# Altium schematic sheet 热敏开关-modifi.SchDoc
size A4
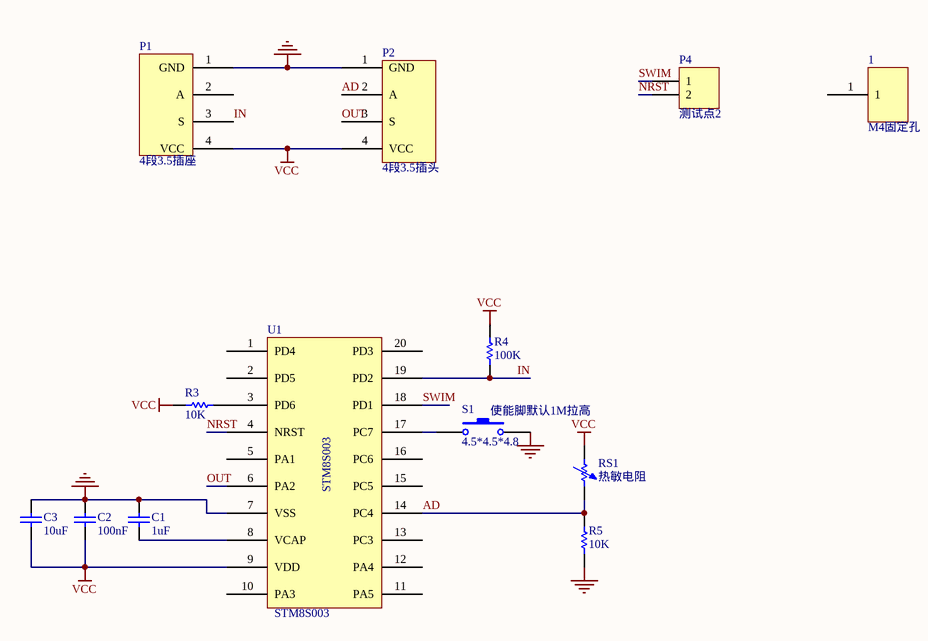
[diagram p0: 热敏开关-modifi.SchDoc]

## Parts
1  M4固定孔  [M4固定孔]
C1  1uF  [0603C]
C2  100nF  [0603C]
C3  10uF  [0603C]
P1  4段3.5插座  [4段3.5耳机贴片座]
P2  4段3.5插头  [4段3.5插头]
P4  测试点2  [2SMT-2.54]
R3  10K  [0603R]
R4  100K  [0603R]
R5  10K  [0603R]
RS1  热敏电阻  [PH2.0-2P]
S1  4.5*4.5*4.8  [按键4.5*4.5*4.8]
U1  STM8S003  [TSSOP20]

## Nets
GND: C1.2 C2.2 C3.2 P1.1(GND) P2.1(GND) R5.1 S1.2 U1.7(VSS)
VCC: C2.1 C3.1 P1.4(VCC) P2.4(VCC) R3.2 R4.1 RS1.1 U1.9(VDD)
AD: P2.2(A) R5.2 RS1.2 U1.14(PC4)
IN: P1.3(S) R4.2 U1.19(PD2)
NRST: P4.2 U1.4(NRST)
OUT: P2.3(S) U1.6(PA2)
SWIM: P4.1 U1.18(PD1)
NetC1_1: C1.1 U1.8(VCAP)
NetR3_1: R3.1 U1.3(PD6)
NetS1_1: S1.1 U1.17(PC7)

Not connected (* = marked no-connect by the designer): 1 1; P1 2(A); U1 1(PD4) 2(PD5) 5(PA1) 10(PA3) 11(PA5) 12(PA4) 13(PC3) 15(PC5) 16(PC6) 20(PD3)

## Notes on the sheet
- (near S1) 使能脚默认1M拉高

## Library data of the parts
C1-C3 = Cap: Capacitor; Value: 100pF; Published: 8-Jun-2000; LatestRevisionDate: 17-Jul-2002; LatestRevisionNote: Re-released for DXP Platform.; PackageReference: RAD-0.3; Publisher: Altium Limited; PackageDescription: Radial Cap, Thru-Hole; 2 Leads; 0.3 in Pin Spacing
P4 = Header 2: Header, 2-Pin; LatestRevisionDate: 17-Jul-2002; LatestRevisionNote: Re-released for DXP Platform.; Publisher: Altium Limited
R3-R5 = Res1: Resistor; Value: 1K; Published: 8-Jun-2000; LatestRevisionDate: 17-Jul-2002; LatestRevisionNote: Re-released for DXP Platform.; PackageReference: AXIAL-0.3; Publisher: Altium Limited; PackageDescription: Axial Device, Thru-Hole; 2 Leads; 0.3 in Pin Spacing
RS1 = Res Adj1: Variable Resistor; Value: 1K; Set Position: 0.5; Published: 8-Jun-2000; LatestRevisionDate: 17-Jul-2002; LatestRevisionNote: Re-released for DXP Platform.; PackageReference: AXIAL-0.7; Publisher: Altium Limited; PackageDescription: Axial Device, Thru-Hole; 2 Leads; 0.7 in Pin Spacing
S1 = SW-PB: Switch; Published: 24-Mar-1999; LatestRevisionDate: 17-Jul-2002; LatestRevisionNote: Re-released for DXP Platform.; PackageReference: SPST-2; Publisher: Altium Limited; PackageDescription: Switch; 2 Leads